# EAGLE schematic motor driver (EAGLE 8.0.1)
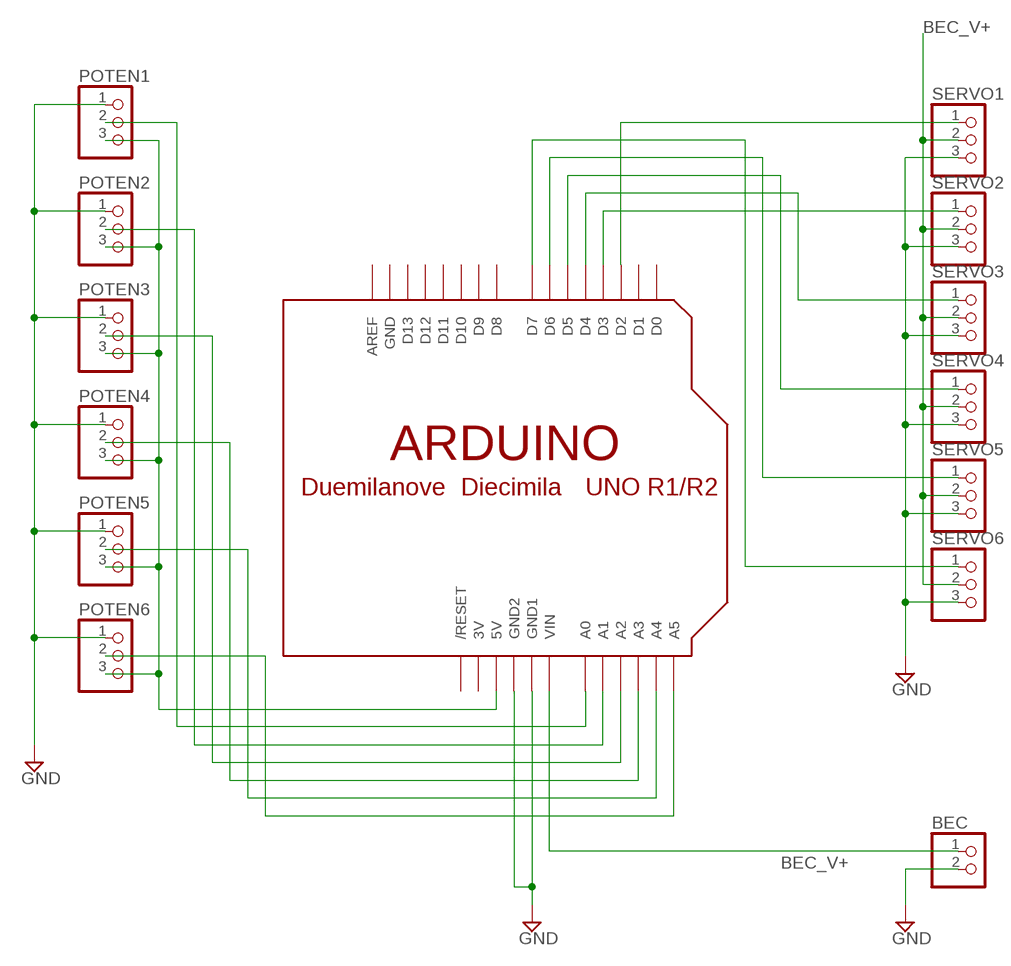
[diagram p0: schematic, sheet 1]

## Parts
BEC  PINHD-1X2  [1X02]
POTEN1  PINHD-1X3  [1X03]
POTEN2  PINHD-1X3  [1X03]
POTEN3  PINHD-1X3  [1X03]
POTEN4  PINHD-1X3  [1X03]
POTEN5  PINHD-1X3  [1X03]
POTEN6  PINHD-1X3  [1X03]
SERVO1  PINHD-1X3  [1X03]
SERVO2  PINHD-1X3  [1X03]
SERVO3  PINHD-1X3  [1X03]
SERVO4  PINHD-1X3  [1X03]
SERVO5  PINHD-1X3  [1X03]
SERVO6  PINHD-1X3  [1X03]
U$1  ARDUINOUNO  [ARDUINO]

## Nets
BEC_V+: BEC.1 SERVO1.2 SERVO2.2 SERVO3.2 SERVO4.2 SERVO5.2 SERVO6.2 U$1.VIN
GND: BEC.2 POTEN1.1 POTEN2.1 POTEN3.1 POTEN4.1 POTEN5.1 POTEN6.1 SERVO1.3 SERVO2.3 SERVO3.3 SERVO4.3 SERVO5.3 SERVO6.3 U$1.GND1 U$1.GND2
N$1: SERVO1.1 U$1.D2
N$2: SERVO2.1 U$1.D3
N$3: SERVO3.1 U$1.D4
N$4: SERVO4.1 U$1.D5
N$5: SERVO5.1 U$1.D6
N$6: SERVO6.1 U$1.D7
N$7: POTEN1.2 U$1.A0
N$8: POTEN1.3 POTEN2.3 POTEN3.3 POTEN4.3 POTEN5.3 POTEN6.3 U$1.5V
N$9: POTEN3.2 U$1.A2
N$10: POTEN2.2 U$1.A1
N$11: POTEN4.2 U$1.A3
N$12: POTEN5.2 U$1.A4
N$13: POTEN6.2 U$1.A5
Unconnected: U$1.AREF U$1.D0 U$1.D1 U$1.D8 U$1.D9 U$1.D10 U$1.D11 U$1.D12 U$1.D13 U$1.RESET(/RESET)

## Power pins joined to a net without a drawn wire
3V: U$1.3V
GND: U$1.GND

## Library data of the parts
BEC = pinhead:PINHD-1X2: PIN HEADER
POTEN1-POTEN6 = pinhead:PINHD-1X3: PIN HEADER
SERVO1-SERVO6 = adafruit:PINHD-1X3: PIN HEADER
U$1 = adafruit:ARDUINO: Arduino Diecimila/Duemilanove Make a shield with ease, this package has all the named pins as well as the two mounting drill holes and an outline of the USB and DC power connector. The outline is on the DIMENSION layer, so if your board house uses it they will cut the outline to match. http://www.ladyada.net/library/pcb/eaglelibrary.html